# Altium project PCB_Project.PrjPcb
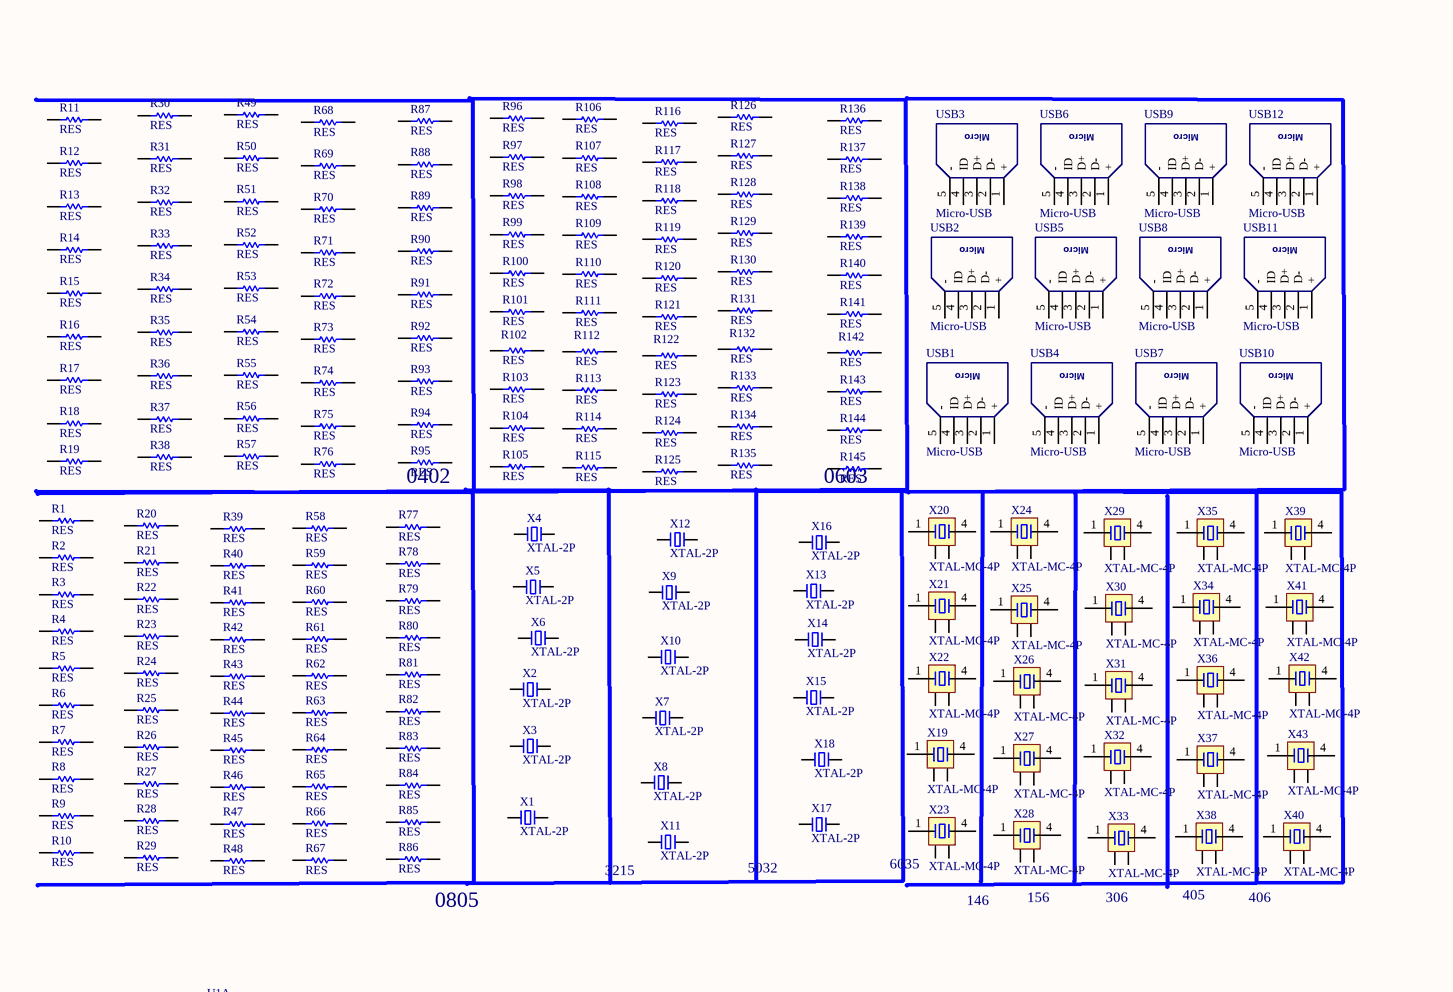
[diagram p0: Sheet1.SchDoc, top left]
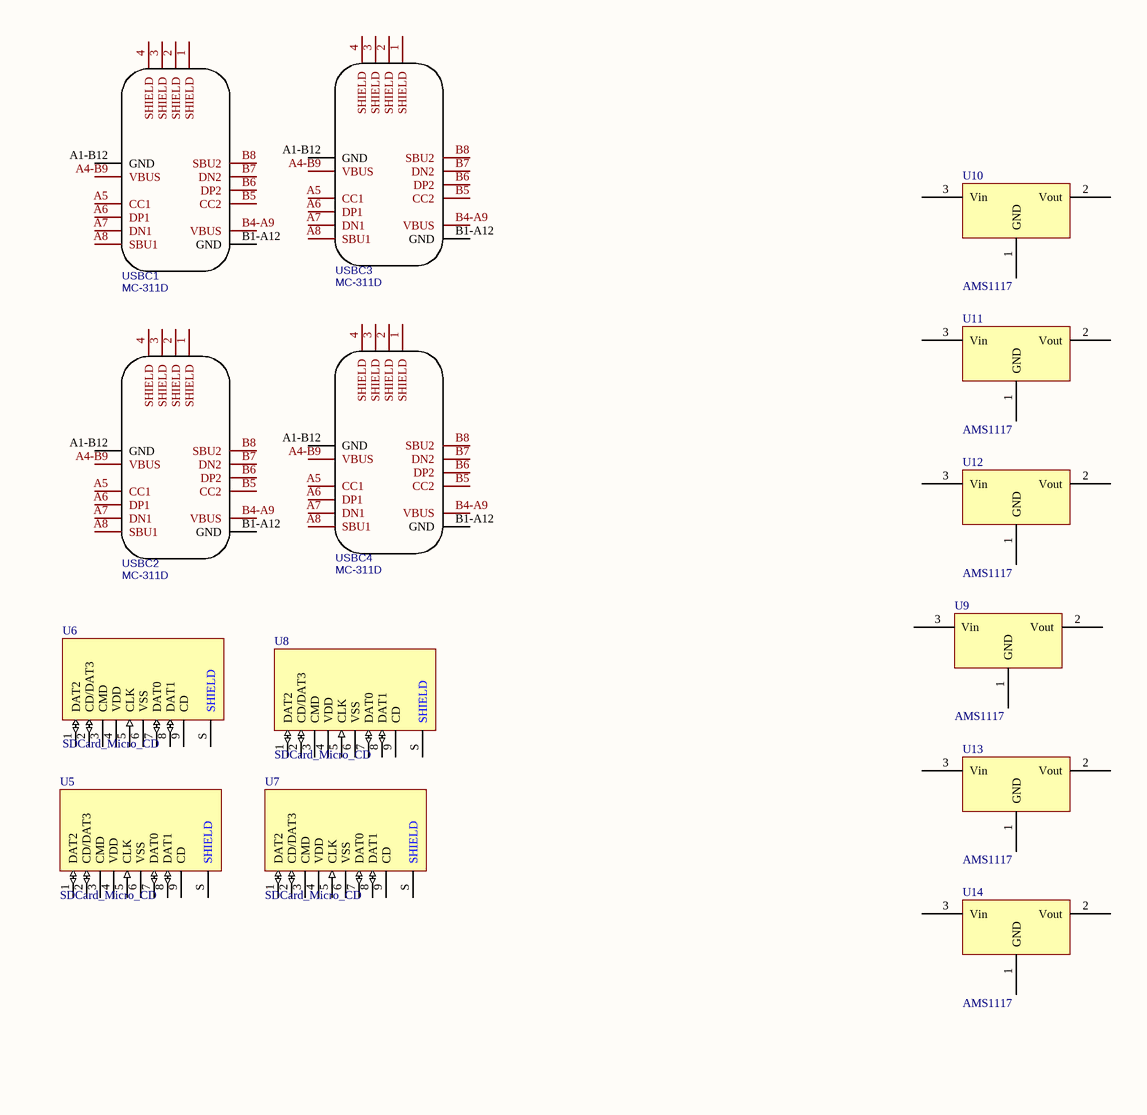
[diagram p1: Sheet1.SchDoc, top right]
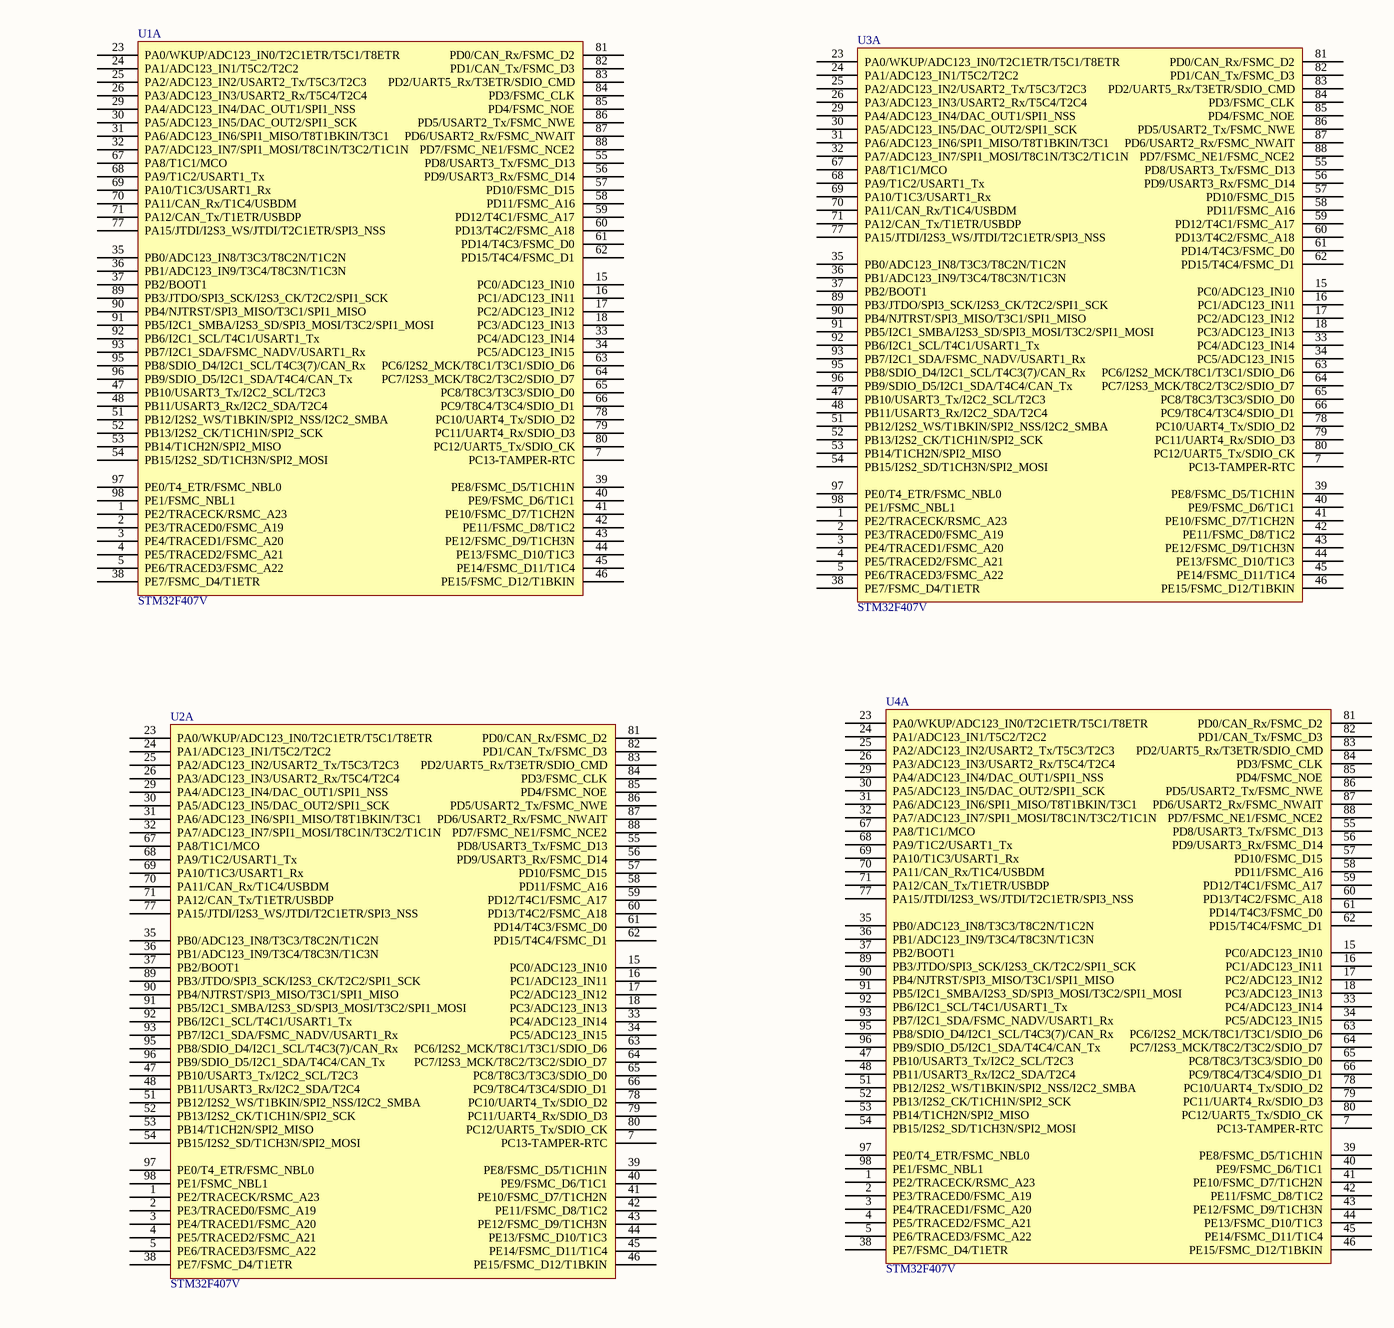
[diagram p2: Sheet1.SchDoc, bottom left]
1 sheet, 218 parts. Net scope: global (net labels, ports and power ports of the same name join across sheets).
Board file: PCB1.PcbDoc

## Sheet Sheet1.SchDoc
size A1

### Parts
R1  RES  [0805R]
R2  RES  [0805R]
R3  RES  [0805R]
R4  RES  [0805R]
R5  RES  [0805R]
R6  RES  [0805R]
R7  RES  [0805R]
R8  RES  [0805R]
R9  RES  [0805R]
R10  RES  [0805R]
R11  RES  [0402R]
R12  RES  [0402R]
R13  RES  [0402R]
R14  RES  [0402R]
R15  RES  [0402R]
R16  RES  [0402R]
R17  RES  [0402R]
R18  RES  [0402R]
R19  RES  [0402R]
R20  RES  [0805R]
R21  RES  [0805R]
R22  RES  [0805R]
R23  RES  [0805R]
R24  RES  [0805R]
R25  RES  [0805R]
R26  RES  [0805R]
R27  RES  [0805R]
R28  RES  [0805R]
R29  RES  [0805R]
R30  RES  [0402R]
R31  RES  [0402R]
R32  RES  [0402R]
R33  RES  [0402R]
R34  RES  [0402R]
R35  RES  [0402R]
R36  RES  [0402R]
R37  RES  [0402R]
R38  RES  [0402R]
R39  RES  [0805R]
R40  RES  [0805R]
R41  RES  [0805R]
R42  RES  [0805R]
R43  RES  [0805R]
R44  RES  [0805R]
R45  RES  [0805R]
R46  RES  [0805R]
R47  RES  [0805R]
R48  RES  [0805R]
R49  RES  [0402R]
R50  RES  [0402R]
R51  RES  [0402R]
R52  RES  [0402R]
R53  RES  [0402R]
R54  RES  [0402R]
R55  RES  [0402R]
R56  RES  [0402R]
R57  RES  [0402R]
R58  RES  [0805R]
R59  RES  [0805R]
R60  RES  [0805R]
R61  RES  [0805R]
R62  RES  [0805R]
R63  RES  [0805R]
R64  RES  [0805R]
R65  RES  [0805R]
R66  RES  [0805R]
R67  RES  [0805R]
R68  RES  [0402R]
R69  RES  [0402R]
R70  RES  [0402R]
R71  RES  [0402R]
R72  RES  [0402R]
R73  RES  [0402R]
R74  RES  [0402R]
R75  RES  [0402R]
R76  RES  [0402R]
R77  RES  [0805R]
R78  RES  [0805R]
R79  RES  [0805R]
R80  RES  [0805R]
R81  RES  [0805R]
R82  RES  [0805R]
R83  RES  [0805R]
R84  RES  [0805R]
R85  RES  [0805R]
R86  RES  [0805R]
R87  RES  [0402R]
R88  RES  [0402R]
R89  RES  [0402R]
R90  RES  [0402R]
R91  RES  [0402R]
R92  RES  [0402R]
R93  RES  [0402R]
R94  RES  [0402R]
R95  RES  [0402R]
R96  RES  [0603R]
R97  RES  [0603R]
R98  RES  [0603R]
R99  RES  [0603R]
R100  RES  [0603R]
R101  RES  [0603R]
R102  RES  [0603R]
R103  RES  [0603R]
R104  RES  [0603R]
R105  RES  [0603R]
R106  RES  [0603R]
R107  RES  [0603R]
R108  RES  [0603R]
R109  RES  [0603R]
R110  RES  [0603R]
R111  RES  [0603R]
R112  RES  [0603R]
R113  RES  [0603R]
R114  RES  [0603R]
R115  RES  [0603R]
R116  RES  [0603R]
R117  RES  [0603R]
R118  RES  [0603R]
R119  RES  [0603R]
R120  RES  [0603R]
R121  RES  [0603R]
R122  RES  [0603R]
R123  RES  [0603R]
R124  RES  [0603R]
R125  RES  [0603R]
R126  RES  [0603R]
R127  RES  [0603R]
R128  RES  [0603R]
R129  RES  [0603R]
R130  RES  [0603R]
R131  RES  [0603R]
R132  RES  [0603R]
R133  RES  [0603R]
R134  RES  [0603R]
R135  RES  [0603R]
R136  RES  [0603R]
R137  RES  [0603R]
R138  RES  [0603R]
R139  RES  [0603R]
R140  RES  [0603R]
R141  RES  [0603R]
R142  RES  [0603R]
R143  RES  [0603R]
R144  RES  [0603R]
R145  RES  [0603R]
U1  STM32F407V  [LQFP100 14x14_M]  (part A of 2)
U2  STM32F407V  [LQFP100 14x14_M]  (part A of 2)
U3  STM32F407V  [LQFP100 14x14_M]  (part A of 2)
U4  STM32F407V  [LQFP100 14x14_M]  (part A of 2)
U5  SDCard_Micro_CD  [SDCard_Micro-Push]
U6  SDCard_Micro_CD  [SDCard_Micro-Push]
U7  SDCard_Micro_CD  [SDCard_Micro-Push]
U8  SDCard_Micro_CD  [SDCard_Micro-Push]
U9  AMS1117  [SOT223]
U10  AMS1117  [SOT223]
U11  AMS1117  [SOT223]
U12  AMS1117  [SOT223]
U13  AMS1117  [SOT223]
U14  AMS1117  [SOT223]
USB1  Micro-USB  [USB-MICRO_A]
USB2  Micro-USB  [USB-MICRO_A]
USB3  Micro-USB  [USB-MICRO_A]
USB4  Micro-USB  [USB-MICRO_A]
USB5  Micro-USB  [USB-MICRO_A]
USB6  Micro-USB  [USB-MICRO_A]
USB7  Micro-USB  [USB-MICRO_A]
USB8  Micro-USB  [USB-MICRO_A]
USB9  Micro-USB  [USB-MICRO_A]
USB10  Micro-USB  [USB-MICRO_A]
USB11  Micro-USB  [USB-MICRO_A]
USB12  Micro-USB  [USB-MICRO_A]
USBC1  MC-311D  [USB-C-12P]
USBC2  MC-311D  [USB-C-12P]
USBC3  MC-311D  [USB-C-12P]
USBC4  MC-311D  [USB-C-12P]
X1  XTAL-2P  [OSC 3215-2P]
X2  XTAL-2P  [OSC 3215-2P]
X3  XTAL-2P  [OSC 3215-2P]
X4  XTAL-2P  [OSC 3215-2P]
X5  XTAL-2P  [OSC 3215-2P]
X6  XTAL-2P  [OSC 3215-2P]
X7  XTAL-2P  [OSC 5032-2P]
X8  XTAL-2P  [OSC 5032-2P]
X9  XTAL-2P  [OSC 5032-2P]
X10  XTAL-2P  [OSC 5032-2P]
X11  XTAL-2P  [OSC 5032-2P]
X12  XTAL-2P  [OSC 5032-2P]
X13  XTAL-2P  [OSC 6035-2P]
X14  XTAL-2P  [OSC 6035-2P]
X15  XTAL-2P  [OSC 6035-2P]
X16  XTAL-2P  [OSC 6035-2P]
X17  XTAL-2P  [OSC 6035-2P]
X18  XTAL-2P  [OSC 6035-2P]
X19  XTAL-MC-4P  [OSC MC-146]
X20  XTAL-MC-4P  [OSC MC-146]
X21  XTAL-MC-4P  [OSC MC-146]
X22  XTAL-MC-4P  [OSC MC-146]
X23  XTAL-MC-4P  [OSC MC-146]
X24  XTAL-MC-4P  [OSC MC-156]
X25  XTAL-MC-4P  [OSC MC-156]
X26  XTAL-MC-4P  [OSC MC-156]
X27  XTAL-MC-4P  [OSC MC-156]
X28  XTAL-MC-4P  [OSC MC-156]
X29  XTAL-MC-4P  [OSC MC-306]
X30  XTAL-MC-4P  [OSC MC-306]
X31  XTAL-MC-4P  [OSC MC-306]
X32  XTAL-MC-4P  [OSC MC-306]
X33  XTAL-MC-4P  [OSC MC-306]
X34  XTAL-MC-4P  [OSC MC-405]
X35  XTAL-MC-4P  [OSC MC-405]
X36  XTAL-MC-4P  [OSC MC-405]
X37  XTAL-MC-4P  [OSC MC-405]
X38  XTAL-MC-4P  [OSC MC-405]
X39  XTAL-MC-4P  [OSC MC-406]
X40  XTAL-MC-4P  [OSC MC-405]
X41  XTAL-MC-4P  [OSC MC-405]
X42  XTAL-MC-4P  [OSC MC-405]
X43  XTAL-MC-4P  [OSC MC-405]

### Nets

Not connected (* = marked no-connect by the designer): R1 1 2; R2 1 2; R3 1 2; R4 1 2; R5 1 2; R6 1 2; R7 1 2; R8 1 2; R9 1 2; R10 1 2; R11 1 2; R12 1 2; R13 1 2; R14 1 2; R15 1 2; R16 1 2; R17 1 2; R18 1 2; R19 1 2; R20 1 2; R21 1 2; R22 1 2; R23 1 2; R24 1 2; R25 1 2; R26 1 2; R27 1 2; R28 1 2; R29 1 2; R30 1 2; R31 1 2; R32 1 2; R33 1 2; R34 1 2; R35 1 2; R36 1 2; R37 1 2; R38 1 2; R39 1 2; R40 1 2; R41 1 2; R42 1 2; R43 1 2; R44 1 2; R45 1 2; R46 1 2; R47 1 2; R48 1 2; R49 1 2; R50 1 2; R51 1 2; R52 1 2; R53 1 2; R54 1 2; R55 1 2; R56 1 2; R57 1 2; R58 1 2; R59 1 2; R60 1 2; R61 1 2; R62 1 2; R63 1 2; R64 1 2; R65 1 2; R66 1 2; R67 1 2; R68 1 2; R69 1 2; R70 1 2; R71 1 2; R72 1 2; R73 1 2; R74 1 2; R75 1 2; R76 1 2; R77 1 2; R78 1 2; R79 1 2; R80 1 2; R81 1 2; R82 1 2; R83 1 2; R84 1 2; R85 1 2; R86 1 2; R87 1 2; R88 1 2; R89 1 2; R90 1 2; R91 1 2; R92 1 2; R93 1 2; R94 1 2; R95 1 2; R96 1 2; R97 1 2; R98 1 2; R99 1 2; R100 1 2; R101 1 2; R102 1 2; R103 1 2; R104 1 2; R105 1 2; R106 1 2; R107 1 2; R108 1 2; R109 1 2; R110 1 2; R111 1 2; R112 1 2; R113 1 2; R114 1 2; R115 1 2; R116 1 2; R117 1 2; R118 1 2; R119 1 2; R120 1 2; R121 1 2; R122 1 2; R123 1 2; R124 1 2; R125 1 2; R126 1 2; R127 1 2; R128 1 2; R129 1 2; R130 1 2; R131 1 2; R132 1 2; R133 1 2; R134 1 2; R135 1 2; R136 1 2; R137 1 2; R138 1 2; R139 1 2; R140 1 2; R141 1 2; R142 1 2; R143 1 2; R144 1 2; R145 1 2; U1 1(PE2/TRACECK/RSMC_A23) 2(PE3/TRACED0/FSMC_A19) 3(PE4/TRACED1/FSMC_A20) 4(PE5/TRACED2/FSMC_A21) 5(PE6/TRACED3/FSMC_A22) 7(PC13-TAMPER-RTC) 15(PC0/ADC123_IN10) 16(PC1/ADC123_IN11) 17(PC2/ADC123_IN12) 18(PC3/ADC123_IN13) 23(PA0/WKUP/ADC123_IN0/T2C1ETR/T5C1/T8ETR) 24(PA1/ADC123_IN1/T5C2/T2C2) 25(PA2/ADC123_IN2/USART2_Tx/T5C3/T2C3) 26(PA3/ADC123_IN3/USART2_Rx/T5C4/T2C4) 29(PA4/ADC123_IN4/DAC_OUT1/SPI1_NSS) 30(PA5/ADC123_IN5/DAC_OUT2/SPI1_SCK) 31(PA6/ADC123_IN6/SPI1_MISO/T8T1BKIN/T3C1) 32(PA7/ADC123_IN7/SPI1_MOSI/T8C1N/T3C2/T1C1N) 33(PC4/ADC123_IN14) 34(PC5/ADC123_IN15) 35(PB0/ADC123_IN8/T3C3/T8C2N/T1C2N) 36(PB1/ADC123_IN9/T3C4/T8C3N/T1C3N) 37(PB2/BOOT1) 38(PE7/FSMC_D4/T1ETR) 39(PE8/FSMC_D5/T1CH1N) 40(PE9/FSMC_D6/T1C1) 41(PE10/FSMC_D7/T1CH2N) 42(PE11/FSMC_D8/T1C2) 43(PE12/FSMC_D9/T1CH3N) 44(PE13/FSMC_D10/T1C3) 45(PE14/FSMC_D11/T1C4) 46(PE15/FSMC_D12/T1BKIN) 47(PB10/USART3_Tx/I2C2_SCL/T2C3) 48(PB11/USART3_Rx/I2C2_SDA/T2C4) 51(PB12/I2S2_WS/T1BKIN/SPI2_NSS/I2C2_SMBA) 52(PB13/I2S2_CK/T1CH1N/SPI2_SCK) 53(PB14/T1CH2N/SPI2_MISO) 54(PB15/I2S2_SD/T1CH3N/SPI2_MOSI) 55(PD8/USART3_Tx/FSMC_D13) 56(PD9/USART3_Rx/FSMC_D14) 57(PD10/FSMC_D15) 58(PD11/FSMC_A16) 59(PD12/T4C1/FSMC_A17) 60(PD13/T4C2/FSMC_A18) 61(PD14/T4C3/FSMC_D0) 62(PD15/T4C4/FSMC_D1) 63(PC6/I2S2_MCK/T8C1/T3C1/SDIO_D6) 64(PC7/I2S3_MCK/T8C2/T3C2/SDIO_D7) 65(PC8/T8C3/T3C3/SDIO_D0) 66(PC9/T8C4/T3C4/SDIO_D1) 67(PA8/T1C1/MCO) 68(PA9/T1C2/USART1_Tx) 69(PA10/T1C3/USART1_Rx) 70(PA11/CAN_Rx/T1C4/USBDM) 71(PA12/CAN_Tx/T1ETR/USBDP) 77(PA15/JTDI/I2S3_WS/JTDI/T2C1ETR/SPI3_NSS) 78(PC10/UART4_Tx/SDIO_D2) 79(PC11/UART4_Rx/SDIO_D3) 80(PC12/UART5_Tx/SDIO_CK) 81(PD0/CAN_Rx/FSMC_D2) 82(PD1/CAN_Tx/FSMC_D3) 83(PD2/UART5_Rx/T3ETR/SDIO_CMD) 84(PD3/FSMC_CLK) 85(PD4/FSMC_NOE) 86(PD5/USART2_Tx/FSMC_NWE) 87(PD6/USART2_Rx/FSMC_NWAIT) 88(PD7/FSMC_NE1/FSMC_NCE2) 89(PB3/JTDO/SPI3_SCK/I2S3_CK/T2C2/SPI1_SCK) 90(PB4/NJTRST/SPI3_MISO/T3C1/SPI1_MISO) 91(PB5/I2C1_SMBA/I2S3_SD/SPI3_MOSI/T3C2/SPI1_MOSI) 92(PB6/I2C1_SCL/T4C1/USART1_Tx) 93(PB7/I2C1_SDA/FSMC_NADV/USART1_Rx) 95(PB8/SDIO_D4/I2C1_SCL/T4C3(7)/CAN_Rx) 96(PB9/SDIO_D5/I2C1_SDA/T4C4/CAN_Tx) 97(PE0/T4_ETR/FSMC_NBL0) 98(PE1/FSMC_NBL1); U2 1(PE2/TRACECK/RSMC_A23) 2(PE3/TRACED0/FSMC_A19) 3(PE4/TRACED1/FSMC_A20) 4(PE5/TRACED2/FSMC_A21) 5(PE6/TRACED3/FSMC_A22) 7(PC13-TAMPER-RTC) 15(PC0/ADC123_IN10) 16(PC1/ADC123_IN11) 17(PC2/ADC123_IN12) 18(PC3/ADC123_IN13) 23(PA0/WKUP/ADC123_IN0/T2C1ETR/T5C1/T8ETR) 24(PA1/ADC123_IN1/T5C2/T2C2) 25(PA2/ADC123_IN2/USART2_Tx/T5C3/T2C3) 26(PA3/ADC123_IN3/USART2_Rx/T5C4/T2C4) 29(PA4/ADC123_IN4/DAC_OUT1/SPI1_NSS) 30(PA5/ADC123_IN5/DAC_OUT2/SPI1_SCK) 31(PA6/ADC123_IN6/SPI1_MISO/T8T1BKIN/T3C1) 32(PA7/ADC123_IN7/SPI1_MOSI/T8C1N/T3C2/T1C1N) 33(PC4/ADC123_IN14) 34(PC5/ADC123_IN15) 35(PB0/ADC123_IN8/T3C3/T8C2N/T1C2N) 36(PB1/ADC123_IN9/T3C4/T8C3N/T1C3N) 37(PB2/BOOT1) 38(PE7/FSMC_D4/T1ETR) 39(PE8/FSMC_D5/T1CH1N) 40(PE9/FSMC_D6/T1C1) 41(PE10/FSMC_D7/T1CH2N) 42(PE11/FSMC_D8/T1C2) 43(PE12/FSMC_D9/T1CH3N) 44(PE13/FSMC_D10/T1C3) 45(PE14/FSMC_D11/T1C4) 46(PE15/FSMC_D12/T1BKIN) 47(PB10/USART3_Tx/I2C2_SCL/T2C3) 48(PB11/USART3_Rx/I2C2_SDA/T2C4) 51(PB12/I2S2_WS/T1BKIN/SPI2_NSS/I2C2_SMBA) 52(PB13/I2S2_CK/T1CH1N/SPI2_SCK) 53(PB14/T1CH2N/SPI2_MISO) 54(PB15/I2S2_SD/T1CH3N/SPI2_MOSI) 55(PD8/USART3_Tx/FSMC_D13) 56(PD9/USART3_Rx/FSMC_D14) 57(PD10/FSMC_D15) 58(PD11/FSMC_A16) 59(PD12/T4C1/FSMC_A17) 60(PD13/T4C2/FSMC_A18) 61(PD14/T4C3/FSMC_D0) 62(PD15/T4C4/FSMC_D1) 63(PC6/I2S2_MCK/T8C1/T3C1/SDIO_D6) 64(PC7/I2S3_MCK/T8C2/T3C2/SDIO_D7) 65(PC8/T8C3/T3C3/SDIO_D0) 66(PC9/T8C4/T3C4/SDIO_D1) 67(PA8/T1C1/MCO) 68(PA9/T1C2/USART1_Tx) 69(PA10/T1C3/USART1_Rx) 70(PA11/CAN_Rx/T1C4/USBDM) 71(PA12/CAN_Tx/T1ETR/USBDP) 77(PA15/JTDI/I2S3_WS/JTDI/T2C1ETR/SPI3_NSS) 78(PC10/UART4_Tx/SDIO_D2) 79(PC11/UART4_Rx/SDIO_D3) 80(PC12/UART5_Tx/SDIO_CK) 81(PD0/CAN_Rx/FSMC_D2) 82(PD1/CAN_Tx/FSMC_D3) 83(PD2/UART5_Rx/T3ETR/SDIO_CMD) 84(PD3/FSMC_CLK) 85(PD4/FSMC_NOE) 86(PD5/USART2_Tx/FSMC_NWE) 87(PD6/USART2_Rx/FSMC_NWAIT) 88(PD7/FSMC_NE1/FSMC_NCE2) 89(PB3/JTDO/SPI3_SCK/I2S3_CK/T2C2/SPI1_SCK) 90(PB4/NJTRST/SPI3_MISO/T3C1/SPI1_MISO) 91(PB5/I2C1_SMBA/I2S3_SD/SPI3_MOSI/T3C2/SPI1_MOSI) 92(PB6/I2C1_SCL/T4C1/USART1_Tx) 93(PB7/I2C1_SDA/FSMC_NADV/USART1_Rx) 95(PB8/SDIO_D4/I2C1_SCL/T4C3(7)/CAN_Rx) 96(PB9/SDIO_D5/I2C1_SDA/T4C4/CAN_Tx) 97(PE0/T4_ETR/FSMC_NBL0) 98(PE1/FSMC_NBL1); U3 1(PE2/TRACECK/RSMC_A23) 2(PE3/TRACED0/FSMC_A19) 3(PE4/TRACED1/FSMC_A20) 4(PE5/TRACED2/FSMC_A21) 5(PE6/TRACED3/FSMC_A22) 7(PC13-TAMPER-RTC) 15(PC0/ADC123_IN10) 16(PC1/ADC123_IN11) 17(PC2/ADC123_IN12) 18(PC3/ADC123_IN13) 23(PA0/WKUP/ADC123_IN0/T2C1ETR/T5C1/T8ETR) 24(PA1/ADC123_IN1/T5C2/T2C2) 25(PA2/ADC123_IN2/USART2_Tx/T5C3/T2C3) 26(PA3/ADC123_IN3/USART2_Rx/T5C4/T2C4) 29(PA4/ADC123_IN4/DAC_OUT1/SPI1_NSS) 30(PA5/ADC123_IN5/DAC_OUT2/SPI1_SCK) 31(PA6/ADC123_IN6/SPI1_MISO/T8T1BKIN/T3C1) 32(PA7/ADC123_IN7/SPI1_MOSI/T8C1N/T3C2/T1C1N) 33(PC4/ADC123_IN14) 34(PC5/ADC123_IN15) 35(PB0/ADC123_IN8/T3C3/T8C2N/T1C2N) 36(PB1/ADC123_IN9/T3C4/T8C3N/T1C3N) 37(PB2/BOOT1) 38(PE7/FSMC_D4/T1ETR) 39(PE8/FSMC_D5/T1CH1N) 40(PE9/FSMC_D6/T1C1) 41(PE10/FSMC_D7/T1CH2N) 42(PE11/FSMC_D8/T1C2) 43(PE12/FSMC_D9/T1CH3N) 44(PE13/FSMC_D10/T1C3) 45(PE14/FSMC_D11/T1C4) 46(PE15/FSMC_D12/T1BKIN) 47(PB10/USART3_Tx/I2C2_SCL/T2C3) 48(PB11/USART3_Rx/I2C2_SDA/T2C4) 51(PB12/I2S2_WS/T1BKIN/SPI2_NSS/I2C2_SMBA) 52(PB13/I2S2_CK/T1CH1N/SPI2_SCK) 53(PB14/T1CH2N/SPI2_MISO) 54(PB15/I2S2_SD/T1CH3N/SPI2_MOSI) 55(PD8/USART3_Tx/FSMC_D13) 56(PD9/USART3_Rx/FSMC_D14) 57(PD10/FSMC_D15) 58(PD11/FSMC_A16) 59(PD12/T4C1/FSMC_A17) 60(PD13/T4C2/FSMC_A18) 61(PD14/T4C3/FSMC_D0) 62(PD15/T4C4/FSMC_D1) 63(PC6/I2S2_MCK/T8C1/T3C1/SDIO_D6) 64(PC7/I2S3_MCK/T8C2/T3C2/SDIO_D7) 65(PC8/T8C3/T3C3/SDIO_D0) 66(PC9/T8C4/T3C4/SDIO_D1) 67(PA8/T1C1/MCO) 68(PA9/T1C2/USART1_Tx) 69(PA10/T1C3/USART1_Rx) 70(PA11/CAN_Rx/T1C4/USBDM) 71(PA12/CAN_Tx/T1ETR/USBDP) 77(PA15/JTDI/I2S3_WS/JTDI/T2C1ETR/SPI3_NSS) 78(PC10/UART4_Tx/SDIO_D2) 79(PC11/UART4_Rx/SDIO_D3) 80(PC12/UART5_Tx/SDIO_CK) 81(PD0/CAN_Rx/FSMC_D2) 82(PD1/CAN_Tx/FSMC_D3) 83(PD2/UART5_Rx/T3ETR/SDIO_CMD) 84(PD3/FSMC_CLK) 85(PD4/FSMC_NOE) 86(PD5/USART2_Tx/FSMC_NWE) 87(PD6/USART2_Rx/FSMC_NWAIT) 88(PD7/FSMC_NE1/FSMC_NCE2) 89(PB3/JTDO/SPI3_SCK/I2S3_CK/T2C2/SPI1_SCK) 90(PB4/NJTRST/SPI3_MISO/T3C1/SPI1_MISO) 91(PB5/I2C1_SMBA/I2S3_SD/SPI3_MOSI/T3C2/SPI1_MOSI) 92(PB6/I2C1_SCL/T4C1/USART1_Tx) 93(PB7/I2C1_SDA/FSMC_NADV/USART1_Rx) 95(PB8/SDIO_D4/I2C1_SCL/T4C3(7)/CAN_Rx) 96(PB9/SDIO_D5/I2C1_SDA/T4C4/CAN_Tx) 97(PE0/T4_ETR/FSMC_NBL0) 98(PE1/FSMC_NBL1); U4 1(PE2/TRACECK/RSMC_A23) 2(PE3/TRACED0/FSMC_A19) 3(PE4/TRACED1/FSMC_A20) 4(PE5/TRACED2/FSMC_A21) 5(PE6/TRACED3/FSMC_A22) 7(PC13-TAMPER-RTC) 15(PC0/ADC123_IN10) 16(PC1/ADC123_IN11) 17(PC2/ADC123_IN12) 18(PC3/ADC123_IN13) 23(PA0/WKUP/ADC123_IN0/T2C1ETR/T5C1/T8ETR) 24(PA1/ADC123_IN1/T5C2/T2C2) 25(PA2/ADC123_IN2/USART2_Tx/T5C3/T2C3) 26(PA3/ADC123_IN3/USART2_Rx/T5C4/T2C4) 29(PA4/ADC123_IN4/DAC_OUT1/SPI1_NSS) 30(PA5/ADC123_IN5/DAC_OUT2/SPI1_SCK) 31(PA6/ADC123_IN6/SPI1_MISO/T8T1BKIN/T3C1) 32(PA7/ADC123_IN7/SPI1_MOSI/T8C1N/T3C2/T1C1N) 33(PC4/ADC123_IN14) 34(PC5/ADC123_IN15) 35(PB0/ADC123_IN8/T3C3/T8C2N/T1C2N) 36(PB1/ADC123_IN9/T3C4/T8C3N/T1C3N) 37(PB2/BOOT1) 38(PE7/FSMC_D4/T1ETR) 39(PE8/FSMC_D5/T1CH1N) 40(PE9/FSMC_D6/T1C1) 41(PE10/FSMC_D7/T1CH2N) 42(PE11/FSMC_D8/T1C2) 43(PE12/FSMC_D9/T1CH3N) 44(PE13/FSMC_D10/T1C3) 45(PE14/FSMC_D11/T1C4) 46(PE15/FSMC_D12/T1BKIN) 47(PB10/USART3_Tx/I2C2_SCL/T2C3) 48(PB11/USART3_Rx/I2C2_SDA/T2C4) 51(PB12/I2S2_WS/T1BKIN/SPI2_NSS/I2C2_SMBA) 52(PB13/I2S2_CK/T1CH1N/SPI2_SCK) 53(PB14/T1CH2N/SPI2_MISO) 54(PB15/I2S2_SD/T1CH3N/SPI2_MOSI) 55(PD8/USART3_Tx/FSMC_D13) 56(PD9/USART3_Rx/FSMC_D14) 57(PD10/FSMC_D15) 58(PD11/FSMC_A16) 59(PD12/T4C1/FSMC_A17) 60(PD13/T4C2/FSMC_A18) 61(PD14/T4C3/FSMC_D0) 62(PD15/T4C4/FSMC_D1) 63(PC6/I2S2_MCK/T8C1/T3C1/SDIO_D6) 64(PC7/I2S3_MCK/T8C2/T3C2/SDIO_D7) 65(PC8/T8C3/T3C3/SDIO_D0) 66(PC9/T8C4/T3C4/SDIO_D1) 67(PA8/T1C1/MCO) 68(PA9/T1C2/USART1_Tx) 69(PA10/T1C3/USART1_Rx) 70(PA11/CAN_Rx/T1C4/USBDM) 71(PA12/CAN_Tx/T1ETR/USBDP) 77(PA15/JTDI/I2S3_WS/JTDI/T2C1ETR/SPI3_NSS) 78(PC10/UART4_Tx/SDIO_D2) 79(PC11/UART4_Rx/SDIO_D3) 80(PC12/UART5_Tx/SDIO_CK) 81(PD0/CAN_Rx/FSMC_D2) 82(PD1/CAN_Tx/FSMC_D3) 83(PD2/UART5_Rx/T3ETR/SDIO_CMD) 84(PD3/FSMC_CLK) 85(PD4/FSMC_NOE) 86(PD5/USART2_Tx/FSMC_NWE) 87(PD6/USART2_Rx/FSMC_NWAIT) 88(PD7/FSMC_NE1/FSMC_NCE2) 89(PB3/JTDO/SPI3_SCK/I2S3_CK/T2C2/SPI1_SCK) 90(PB4/NJTRST/SPI3_MISO/T3C1/SPI1_MISO) 91(PB5/I2C1_SMBA/I2S3_SD/SPI3_MOSI/T3C2/SPI1_MOSI) 92(PB6/I2C1_SCL/T4C1/USART1_Tx) 93(PB7/I2C1_SDA/FSMC_NADV/USART1_Rx) 95(PB8/SDIO_D4/I2C1_SCL/T4C3(7)/CAN_Rx) 96(PB9/SDIO_D5/I2C1_SDA/T4C4/CAN_Tx) 97(PE0/T4_ETR/FSMC_NBL0) 98(PE1/FSMC_NBL1); U5 1(DAT2) 2(CD/DAT3) 3(CMD) 4(VDD) 5(CLK) 6(VSS) 7(DAT0) 8(DAT1) 9(CD) S(SHIELD); U6 1(DAT2) 2(CD/DAT3) 3(CMD) 4(VDD) 5(CLK) 6(VSS) 7(DAT0) 8(DAT1) 9(CD) S(SHIELD); U7 1(DAT2) 2(CD/DAT3) 3(CMD) 4(VDD) 5(CLK) 6(VSS) 7(DAT0) 8(DAT1) 9(CD) S(SHIELD); U8 1(DAT2) 2(CD/DAT3) 3(CMD) 4(VDD) 5(CLK) 6(VSS) 7(DAT0) 8(DAT1) 9(CD) S(SHIELD); U9 1(GND) 2(Vout) 3(Vin); U10 1(GND) 2(Vout) 3(Vin); U11 1(GND) 2(Vout) 3(Vin); U12 1(GND) 2(Vout) 3(Vin); U13 1(GND) 2(Vout) 3(Vin); U14 1(GND) 2(Vout) 3(Vin); USB1 1(+) 2(D-) 3(D+) 4(ID) 5(-); USB2 1(+) 2(D-) 3(D+) 4(ID) 5(-); USB3 1(+) 2(D-) 3(D+) 4(ID) 5(-); USB4 1(+) 2(D-) 3(D+) 4(ID) 5(-); USB5 1(+) 2(D-) 3(D+) 4(ID) 5(-); USB6 1(+) 2(D-) 3(D+) 4(ID) 5(-); USB7 1(+) 2(D-) 3(D+) 4(ID) 5(-); USB8 1(+) 2(D-) 3(D+) 4(ID) 5(-); USB9 1(+) 2(D-) 3(D+) 4(ID) 5(-); USB10 1(+) 2(D-) 3(D+) 4(ID) 5(-); USB11 1(+) 2(D-) 3(D+) 4(ID) 5(-); USB12 1(+) 2(D-) 3(D+) 4(ID) 5(-); USBC1 1(SHIELD) 2(SHIELD) 3(SHIELD) 4(SHIELD) A1-B12(GND) A4-B9(VBUS) A5(CC1) A6(DP1) A7(DN1) A8(SBU1) B1-A12(GND) B4-A9(VBUS) B5(CC2) B6(DP2) B7(DN2) B8(SBU2); USBC2 1(SHIELD) 2(SHIELD) 3(SHIELD) 4(SHIELD) A1-B12(GND) A4-B9(VBUS) A5(CC1) A6(DP1) A7(DN1) A8(SBU1) B1-A12(GND) B4-A9(VBUS) B5(CC2) B6(DP2) B7(DN2) B8(SBU2); USBC3 1(SHIELD) 2(SHIELD) 3(SHIELD) 4(SHIELD) A1-B12(GND) A4-B9(VBUS) A5(CC1) A6(DP1) A7(DN1) A8(SBU1) B1-A12(GND) B4-A9(VBUS) B5(CC2) B6(DP2) B7(DN2) B8(SBU2); USBC4 1(SHIELD) 2(SHIELD) 3(SHIELD) 4(SHIELD) A1-B12(GND) A4-B9(VBUS) A5(CC1) A6(DP1) A7(DN1) A8(SBU1) B1-A12(GND) B4-A9(VBUS) B5(CC2) B6(DP2) B7(DN2) B8(SBU2); X1 1 2; X2 1 2; X3 1 2; X4 1 2; X5 1 2; X6 1 2; X7 1 2; X8 1 2; X9 1 2; X10 1 2; X11 1 2; X12 1 2; X13 1 2; X14 1 2; X15 1 2; X16 1 2; X17 1 2; X18 1 2; X19 1 2 3 4; X20 1 2 3 4; X21 1 2 3 4; X22 1 2 3 4; X23 1 2 3 4; X24 1 2 3 4; X25 1 2 3 4; X26 1 2 3 4; X27 1 2 3 4; X28 1 2 3 4; X29 1 2 3 4; X30 1 2 3 4; X31 1 2 3 4; X32 1 2 3 4; X33 1 2 3 4; X34 1 2 3 4; X35 1 2 3 4; X36 1 2 3 4; X37 1 2 3 4; X38 1 2 3 4; X39 1 2 3 4; X40 1 2 3 4; X41 1 2 3 4; X42 1 2 3 4; X43 1 2 3 4

### Notes on the sheet
- (near R95) 0402
- 0603
- 3215
- 5032
- 6035
- (near R86) 0805
- 146
- (near X28) 156
- (near X33) 306
- 405
- 406
- (in symbol Micro-USB) Micro

### Library data of the parts
U1-U4 = STM32F407V: STM32单片机100引脚
U5-U8 = SDCard_Micro_CD: Micro SDCard with vard detect, TF Card
U9-U14 = AMS1117: 三端稳压芯片
USBC1-USBC4 = USB-C-12P: BOM_Manufacturer: SOFNG; Contributor: LCSC; BOM_Supplier: LCSC; BOM_Supplier Part: C136423; BOM_Manufacturer Part: MC-311D; BOM_JLCPCB Part Class: Extended Part; spicePre: U; spiceSymbolName: MC-311D
X1-X18 = XTAL-2P: 2脚无源脚晶振
X19-X43 = XTAL-MC-4P: MC系列4脚晶振